# Altium schematic sheet 其他外设.SchDoc
size A3
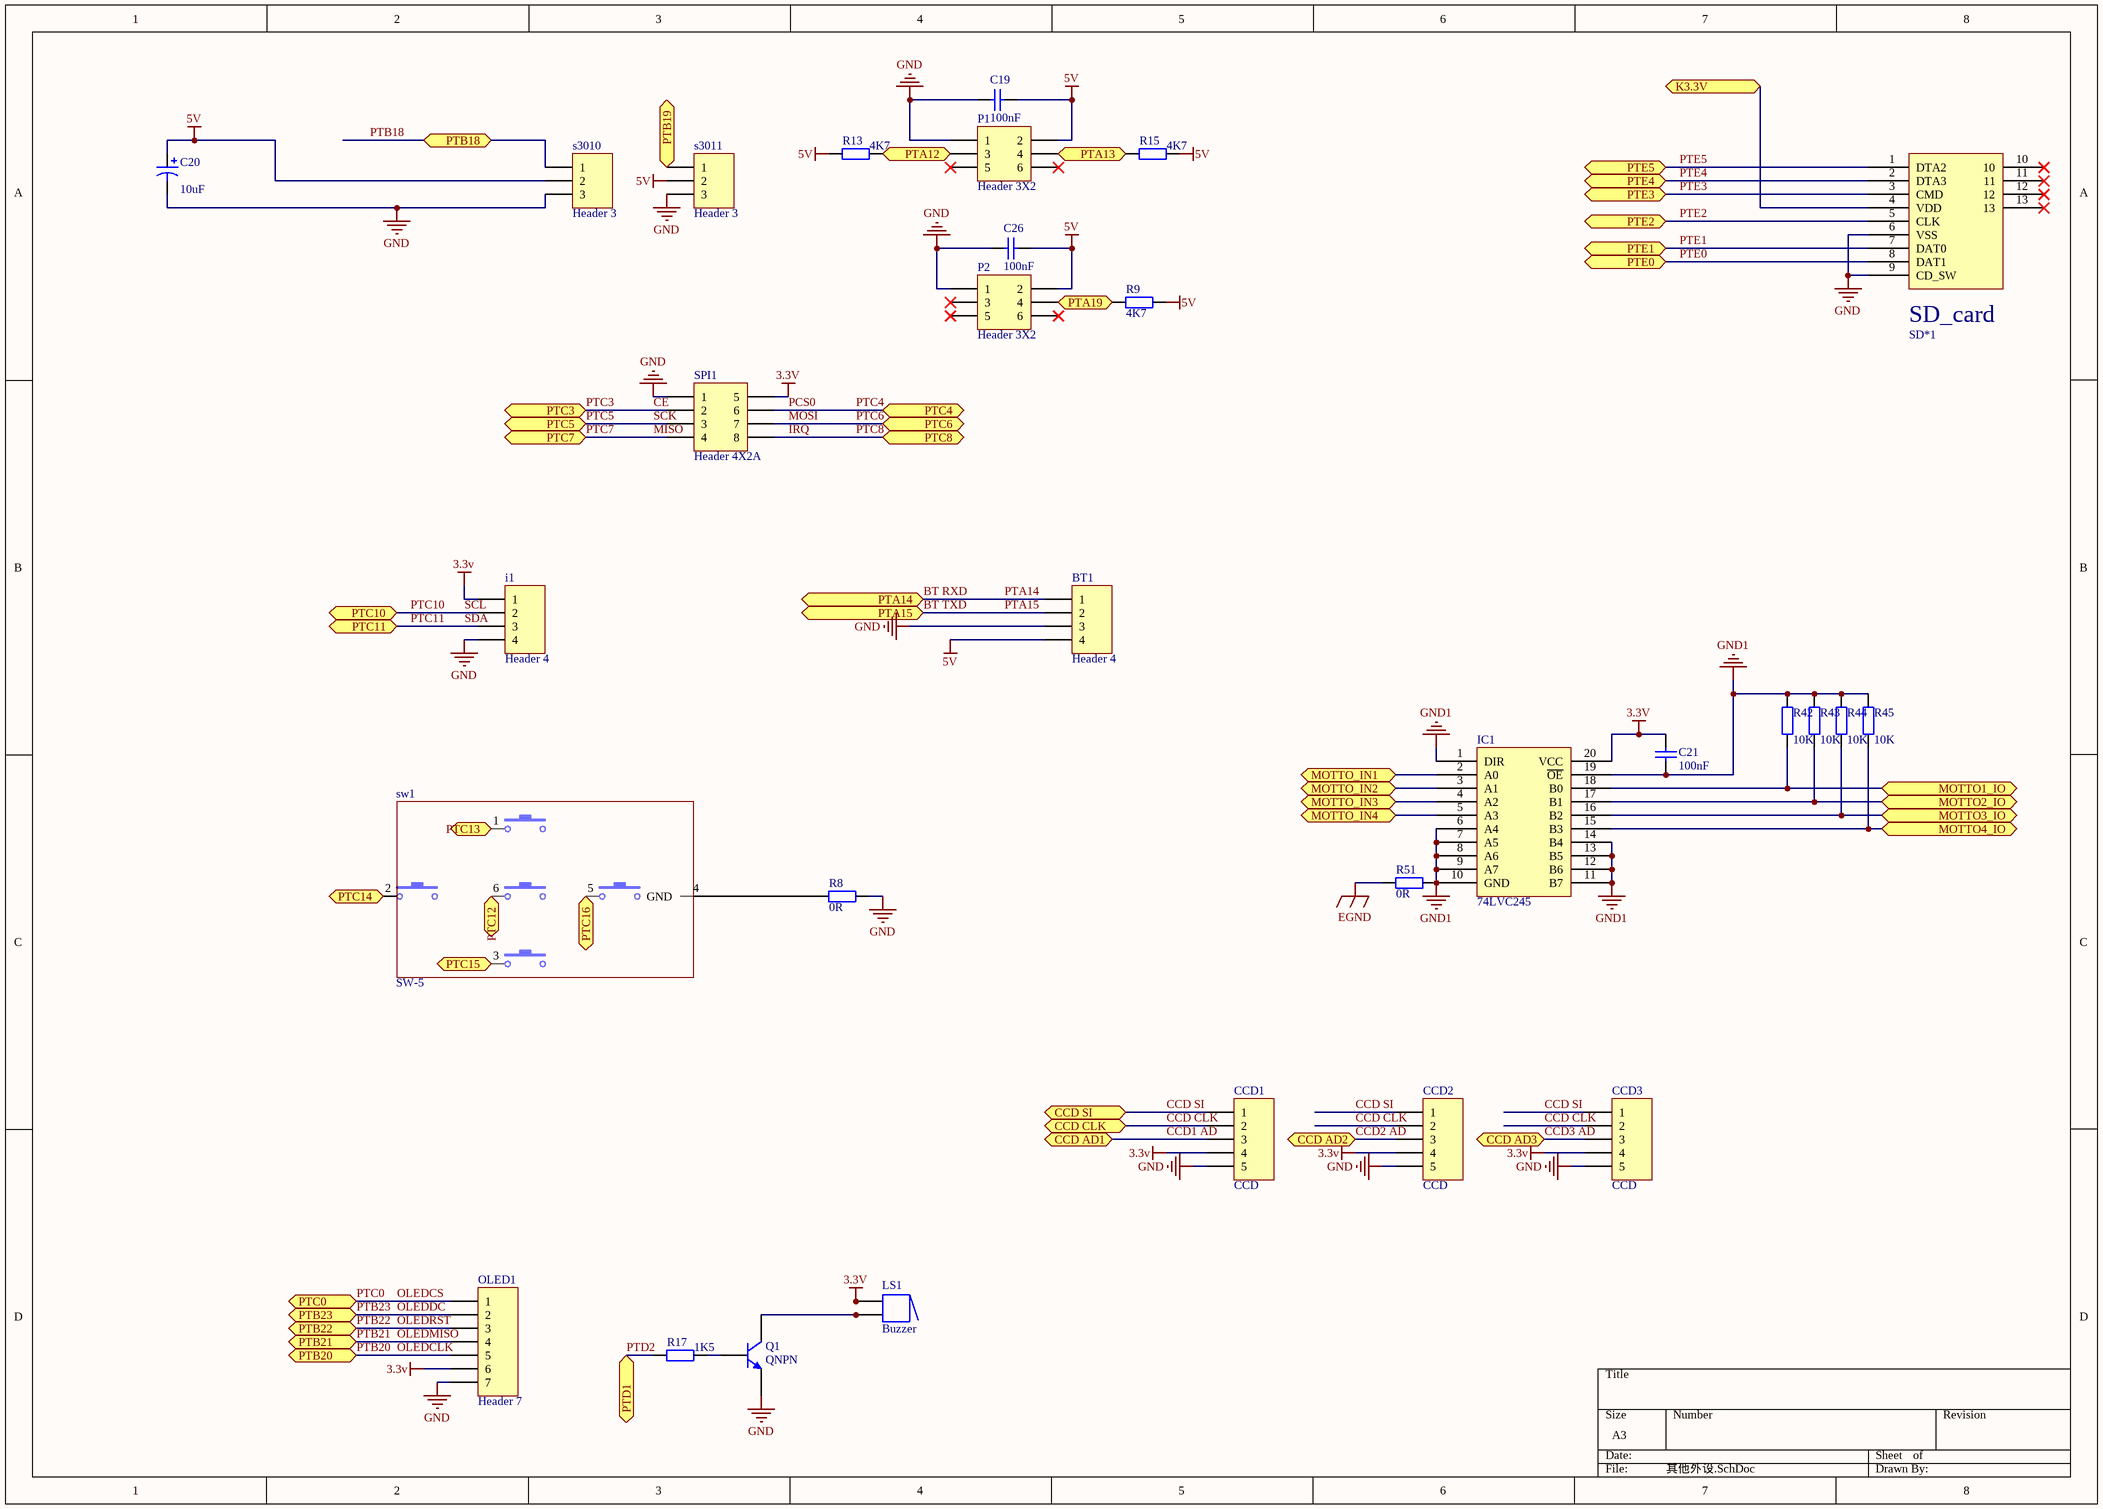
[diagram p0: 其他外设.SchDoc]

## Parts
BT1  Header 4  [HDR1X4]
C19  100nF  [C2012]
C20  value 10uF  [1206(2)]  (hidden comment: Cap Pol1)
C21  100nF  [C2012]
C26  100nF  [C2012]
CCD1  CCD  [HDR1X5]
CCD2  CCD  [HDR1X5]
CCD3  CCD  [HDR1X5]
i1  Header 4  [HDR1X4]
IC1  74LVC245  [TSSOP20 74lvc245]
LS1  Buzzer  [ABSM-1574]
OLED1  Header 7  [HDR1X7]
P1  Header 3X2  [HDR2X3]
P2  Header 3X2  [HDR2X3]
Q1  QNPN  [SOT95P240-3N]
R8  0R  [R2012]
R9  value 4K7  [R2012]  (hidden comment: Res2)
R13  value 4K7  [R2012]  (hidden comment: Res2)
R15  value 4K7  [R2012]  (hidden comment: Res2)
R17  value 1K5  [R2012]  (hidden comment: Res2)
R42  value 10K  [R2012]  (hidden comment: Res2)
R43  value 10K  [R2012]  (hidden comment: Res2)
R44  value 10K  [R2012]  (hidden comment: Res2)
R45  value 10K  [R2012]  (hidden comment: Res2)
R51  value 0R  [1206(2)]  (hidden comment: Res2)
s3010  Header 3  [HDR1X3]
s3011  Header 3  [HDR1X3]
SD*1  TF_card  [SD_card]  (value not drawn)
SPI1  Header 4X2A  [SMT head4*1]
sw1  SW-5  [SW-5]

## Ports
CCD AD1, CCD AD2, CCD AD3, CCD CLK, CCD SI, K3.3V, MOTTO1_IO, MOTTO2_IO, MOTTO3_IO, MOTTO4_IO, MOTTO_IN1, MOTTO_IN2, MOTTO_IN3, MOTTO_IN4, PTA12, PTA13, PTA14, PTA15, PTA19, PTB18, PTB19, PTB20, PTB21, PTB22, PTB23, PTC0, PTC3, PTC4, PTC5, PTC6, PTC7, PTC8, PTC10, PTC11, PTC12, PTC13, PTC14, PTC15, PTC16, PTD1, PTE0, PTE1, PTE2, PTE3, PTE4, PTE5

## Nets
3.3v: C21.1 CCD1.4 CCD2.4 CCD3.4 i1.1 IC1.20(VCC) LS1.1 LS1.1A OLED1.6 SPI1.5
5V: BT1.4 C19.2 C20.1 C26.2 P1.2 P2.2 R9.2 R13.2 R15.1 s3010.2 s3011.2
EGND: R51.1
GND: BT1.3 C19.1 C20.2 C26.1 CCD1.5 CCD2.5 CCD3.5 i1.4 OLED1.7 P1.1 P2.1 Q1.3(E) R8.1 s3010.3 s3011.3 SD*1.6(VSS) SD*1.9(CD_SW) SPI1.1
GND1: C21.2 IC1.1(DIR) IC1.6(A4) IC1.7(A5) IC1.8(A6) IC1.9(A7) IC1.10(GND) IC1.11(B7) IC1.12(B6) IC1.13(B5) IC1.14(B4) IC1.19(~{OE}) R42.2 R43.2 R44.2 R45.2 R51.2
BT RXD: BT1.1 ; port PTA14  [also labelled PTA14]
BT TXD: BT1.2 ; port PTA15  [also labelled PTA15]
CCD1 AD: CCD1.3 ; port CCD AD1
CCD2 AD: CCD2.3 ; port CCD AD2
CCD3 AD: CCD3.3 ; port CCD AD3
CCD CLK: CCD1.2 CCD2.2 CCD3.2 ; port CCD CLK
CCD SI: CCD1.1 CCD2.1 CCD3.1 ; port CCD SI
CE: SPI1.2 ; port PTC3  [also labelled PTC3]
IRQ: SPI1.8 ; port PTC8  [also labelled PTC8]
K3.3V: SD*1.4(VDD) ; port K3.3V
MISO: SPI1.4 ; port PTC7  [also labelled PTC7]
MOSI: SPI1.7 ; port PTC6  [also labelled PTC6]
MOTTO1_IO: IC1.18(B0) R42.1 ; port MOTTO1_IO
MOTTO2_IO: IC1.17(B1) R43.1 ; port MOTTO2_IO
MOTTO3_IO: IC1.16(B2) R44.1 ; port MOTTO3_IO
MOTTO4_IO: IC1.15(B3) R45.1 ; port MOTTO4_IO
MOTTO_IN1: IC1.2(A0) ; port MOTTO_IN1
MOTTO_IN2: IC1.3(A1) ; port MOTTO_IN2
MOTTO_IN3: IC1.4(A2) ; port MOTTO_IN3
MOTTO_IN4: IC1.5(A3) ; port MOTTO_IN4
OLEDCLK: OLED1.5 ; port PTB20  [also labelled PTB20]
OLEDCS: OLED1.1 ; port PTC0  [also labelled PTC0]
OLEDDC: OLED1.2 ; port PTB23  [also labelled PTB23]
OLEDMISO: OLED1.4 ; port PTB21  [also labelled PTB21]
OLEDRST: OLED1.3 ; port PTB22  [also labelled PTB22]
PCS0: SPI1.6 ; port PTC4  [also labelled PTC4]
PTA12: P1.3 R13.1 ; port PTA12
PTA13: P1.4 R15.2 ; port PTA13
PTA19: P2.4 R9.1 ; port PTA19
PTB18: s3010.1 ; port PTB18
PTB19: s3011.1 ; port PTB19
PTC5: SPI1.3 ; port PTC5  [also labelled SCK]
PTC10: i1.2 ; port PTC10  [also labelled SCL]
PTC11: i1.3 ; port PTC11  [also labelled SDA]
PTC12: sw1.6 ; port PTC12
PTC13: sw1.1 ; port PTC13
PTC14: sw1.2 ; port PTC14
PTC15: sw1.3 ; port PTC15
PTC16: sw1.5 ; port PTC16
PTD2: R17.2 ; port PTD1
PTE0: SD*1.8(DAT1) ; port PTE0
PTE1: SD*1.7(DAT0) ; port PTE1
PTE2: SD*1.5(CLK) ; port PTE2
PTE3: SD*1.3(CMD) ; port PTE3
PTE4: SD*1.2(DTA3) ; port PTE4
PTE5: SD*1.1(DTA2) ; port PTE5
NetLS1_2: LS1.2 LS1.2A Q1.1(C)
NetQ1_2: Q1.2(B) R17.1
NetR8_2: R8.2 sw1.4(GND)

Not connected (* = marked no-connect by the designer): P1 5* 6*; P2 3* 5* 6*; SD*1 10* 11* 12* 13*

## Notes on the sheet
- (in symbol TF_card) SD_card

## Library data of the parts
BT1 i1 = Header 4: Header, 4-Pin; LatestRevisionDate: 17-Jul-2002; LatestRevisionNote: Re-released for DXP Platform.; Publisher: Altium Limited
C19 C21 C26 = Cap: Capacitor
C20 = Cap Pol1: Polarized Capacitor (Radial); Published: 8-Jun-2000; LatestRevisionDate: 17-Jul-2002; LatestRevisionNote: Re-released for DXP Platform.; PackageReference: RB7.6-15; Publisher: Altium Limited; PackageDescription: Polarized Capacitor (Radial); 2 Leads
CCD1-CCD3 = Header 5: Header, 5-Pin; LatestRevisionDate: 17-Jul-2002; LatestRevisionNote: Re-released for DXP Platform.; Publisher: Altium Limited
LS1 = Buzzer: Magnetic Transducer Buzzer; pin to pad: 1>1A 2>2A; Published: 24-Mar-1999; LatestRevisionDate: 17-Dec-2003; LatestRevisionNote: Schematic revised, PCB Footprint replaced.; DatasheetVersion: 17-Dec-2003; PackageReference: ABSM-1574; Publisher: Altium Limited; ComponentLink1Description: Manufacturer Link; ComponentLink1URL: http://www.megastar.com/linecard/buzzmode/index.php
OLED1 = Header 7: Header, 7-Pin; LatestRevisionDate: 17-Jul-2002; LatestRevisionNote: Re-released for DXP Platform.; Publisher: Altium Limited
P1 P2 = Header 3X2: Header, 3-Pin, Dual row; LatestRevisionDate: 17-Jul-2002; LatestRevisionNote: Re-released for DXP Platform.; Publisher: Altium Limited
Q1 = QNPN: NPN Bipolar Transistor; pin to pad: 1>3 2>1 3>2; Published: 8-Jun-2000; LatestRevisionDate: 29-May-2009; LatestRevisionNote: IPC-7351 Footprint Added.; PackageVersion: Aug-1999; PackageReference: SOT-23B; Publisher: Altium Limited; PackageDescription: 3-Pin SOT-23 Package 0.95 mm Pitch, 2.4 mm Lead Span
R8 = Res: Resistor of led
R9 R13 R15 R17 R42-R45 R51 = Res2: Resistor; Published: 8-Jun-2000; LatestRevisionDate: 17-Jul-2002; LatestRevisionNote: Re-released for DXP Platform.; PackageReference: AXIAL-0.4; Publisher: Altium Limited; PackageDescription: Axial Device, Thru-Hole; 2 Leads; 0.4 in Pin Spacing
s3010 s3011 = Header 3: Header, 3-Pin; LatestRevisionDate: 17-Jul-2002; LatestRevisionNote: Re-released for DXP Platform.; Publisher: Altium Limited
SPI1 = Header 4X2A: Header, 4-Pin, Dual row; LatestRevisionDate: 17-Jul-2002; LatestRevisionNote: Re-released for DXP Platform.; Publisher: Altium Limited